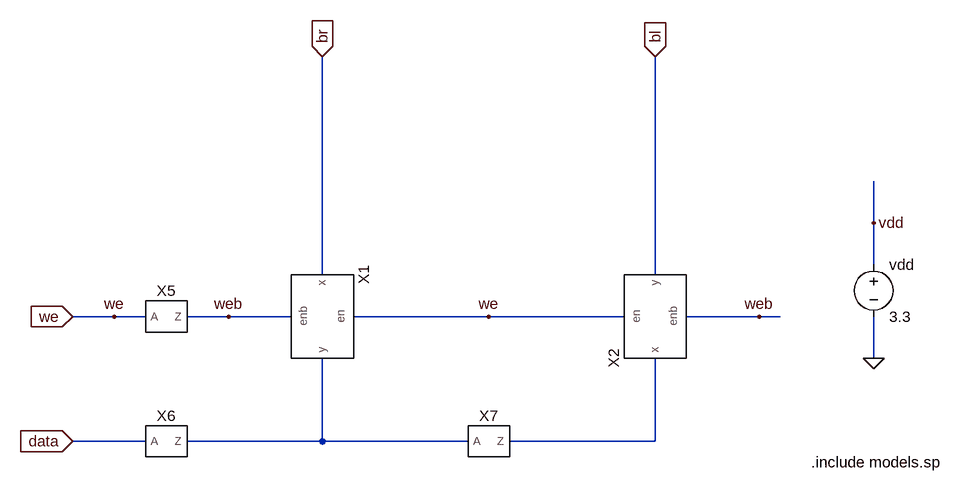
[diagram p0: schematic write_driver.asc]
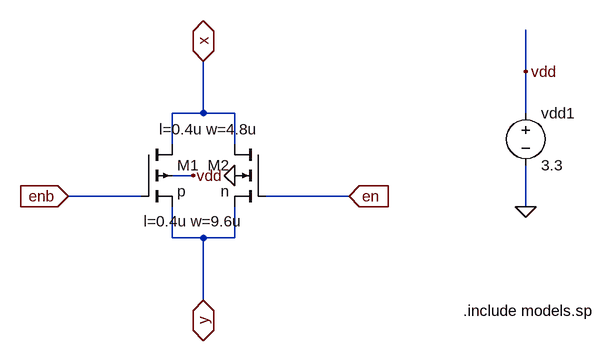
[diagram p1: sub-circuit tri_gate.asc]
write_driver.asc, the LTspice schematic file:
Version 4
SHEET 1 880 680
WIRE 624 -624 624 -688
WIRE 624 -560 624 -624
WIRE -224 -544 -224 -880
WIRE 288 -544 288 -880
WIRE -544 -480 -608 -480
WIRE -496 -480 -544 -480
WIRE -368 -480 -432 -480
WIRE -272 -480 -368 -480
WIRE 32 -480 -176 -480
WIRE 240 -480 32 -480
WIRE 448 -480 336 -480
WIRE 480 -480 448 -480
WIRE 624 -416 624 -480
WIRE -496 -288 -608 -288
WIRE -224 -288 -224 -416
WIRE -224 -288 -432 -288
WIRE 0 -288 -224 -288
WIRE 288 -288 288 -416
WIRE 288 -288 64 -288
FLAG 624 -416 0
FLAG 624 -624 vdd
FLAG -608 -480 we
IOPIN -608 -480 In
FLAG -608 -288 data
IOPIN -608 -288 In
FLAG -224 -880 br
IOPIN -224 -880 In
FLAG 288 -880 bl
IOPIN 288 -880 In
FLAG -368 -480 web
FLAG 32 -480 we
FLAG -544 -480 we
FLAG 448 -480 web
SYMBOL voltage 624 -576 R0
WINDOW 123 0 0 Left 0
WINDOW 39 0 0 Left 0
SYMATTR InstName vdd
SYMATTR Value 3.3
SYMBOL inv -464 -480 R0
SYMATTR InstName X5
SYMBOL inv -464 -288 R0
SYMATTR InstName X6
SYMBOL inv 32 -288 R0
SYMATTR InstName X7
SYMBOL tri_gate -224 -480 R90
SYMATTR InstName X1
SYMBOL tri_gate 288 -480 R270
SYMATTR InstName X2
TEXT 528 -256 Left 2 !.include models.sp

tri_gate.asc, the sub-circuit schematic file:
Version 4
SHEET 1 880 680
WIRE 576 -16 576 -80
WIRE 80 48 80 -32
WIRE 80 48 32 48
WIRE 128 48 80 48
WIRE 576 48 576 -16
WIRE 32 96 32 48
WIRE 128 96 128 48
WIRE 64 144 32 144
WIRE -16 176 -128 176
WIRE 304 176 176 176
WIRE 576 192 576 128
WIRE 32 240 32 192
WIRE 80 240 32 240
WIRE 128 240 128 192
WIRE 128 240 80 240
WIRE 80 336 80 240
FLAG 128 144 0
FLAG 64 144 vdd
FLAG 576 192 0
FLAG 576 -16 vdd
FLAG 80 336 y
IOPIN 80 336 BiDir
FLAG 80 -32 x
IOPIN 80 -32 BiDir
FLAG 304 176 en
IOPIN 304 176 In
FLAG -128 176 enb
IOPIN -128 176 In
SYMBOL pmos4 -16 96 R0
WINDOW 123 4 118 Left 2
SYMATTR Value2 l=0.4u w=9.6u
SYMATTR InstName M1
SYMATTR Value p
SYMBOL nmos4 176 96 M0
WINDOW 123 12 -23 Left 2
SYMATTR Value2 l=0.4u w=4.8u
SYMATTR InstName M2
SYMATTR Value n
SYMBOL voltage 576 32 R0
WINDOW 123 0 0 Left 0
WINDOW 39 0 0 Left 0
SYMATTR InstName vdd1
SYMATTR Value 3.3
TEXT 480 352 Left 2 !.include models.sp

The netlist it stands for:
* write_driver.asc
vdd vdd 0 3.3
XX5 we web inv  ; pins A Z
XX6 data N001 inv  ; pins A Z
XX7 N001 N002 inv  ; pins A Z
XX1 we web br N001 tri_gate
XX2 we web N002 bl tri_gate

* block symbol definitions
.subckt tri_gate en enb x y
M1 x enb y vdd p l=0.4u w=9.6u
M2 x en y 0 n l=0.4u w=4.8u
vdd1 vdd 0 3.3
.include models.sp
.ends tri_gate

.model NMOS NMOS
.model PMOS PMOS
.lib standard.mos
.include models.sp
.backanno
.end